# Altium schematic sheet analog_channel3.SchDoc
size A4; SheetNumber: 4; SheetTotal: 6
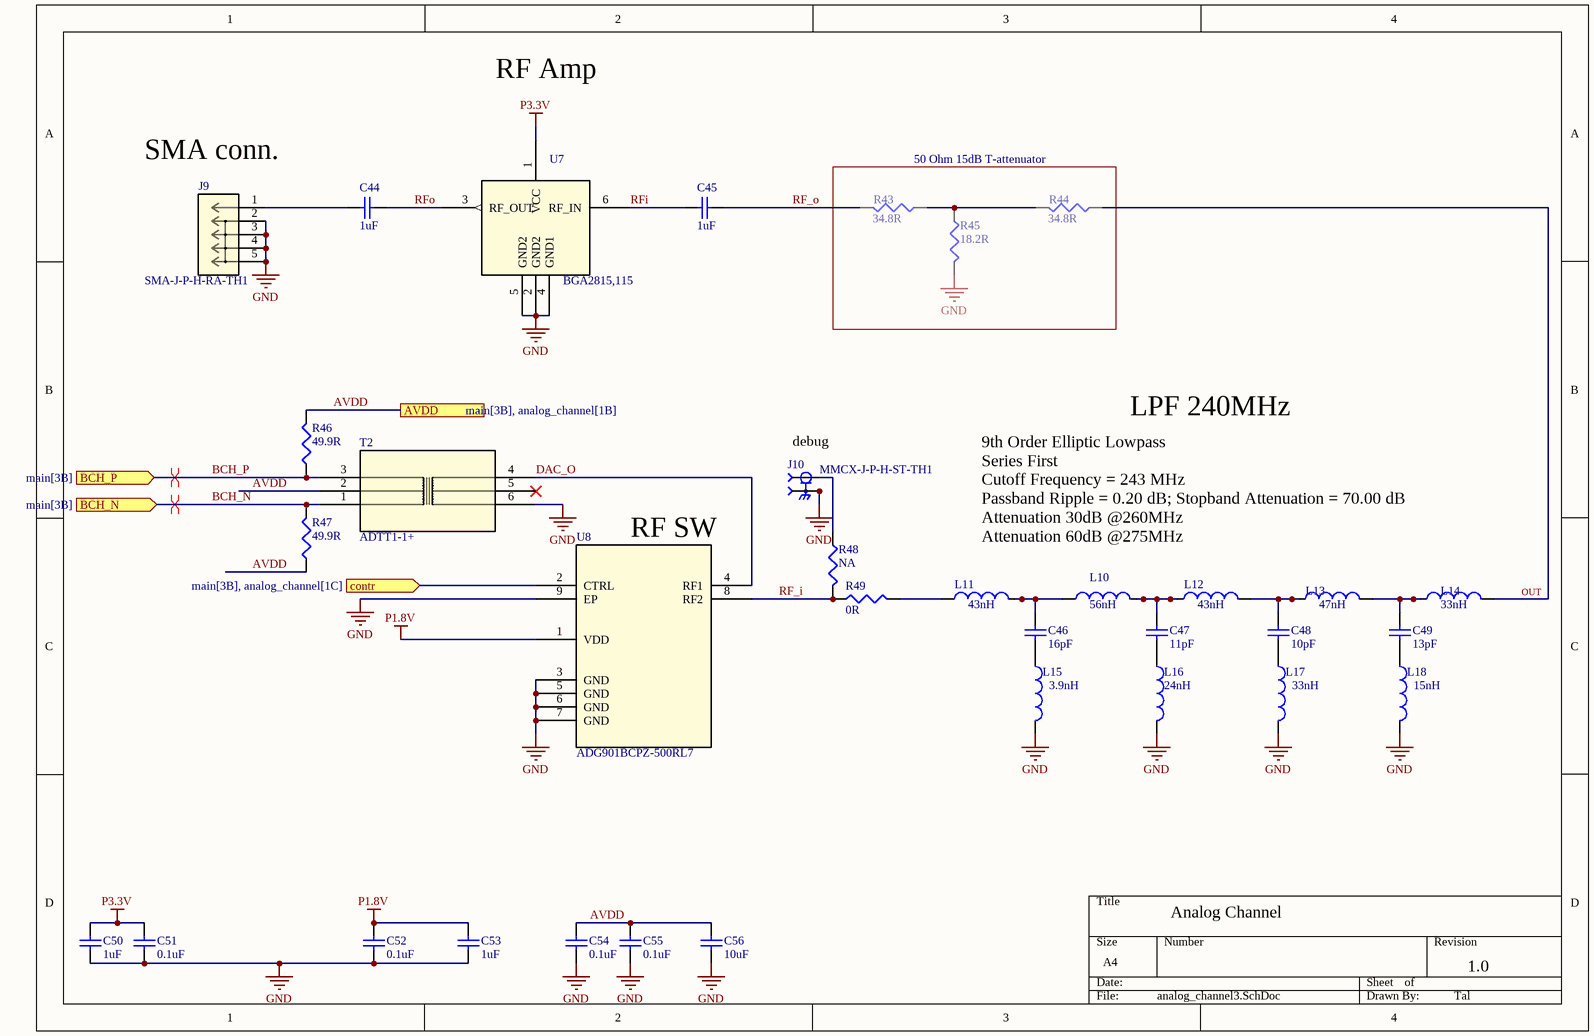
[diagram p0: analog_channel3.SchDoc]

## Parts
C44  Capacitance: 1uF  [c0402]  (hidden comment: 1uF 25V)
C45  Capacitance: 1uF  [c0402]  (hidden comment: 1uF 25V)
C46  Capacitance: 16pF  [c0402]  (hidden comment: 16pF 50V)
C47  Capacitance: 11pF  [c0402]  (hidden comment: 11pF 50V)
C48  Capacitance: 10pF  [c0402]  (hidden comment: 10pF 50V)
C49  Capacitance: 13pF  [c0402]  (hidden comment: 13pF 50V)
C50  Capacitance: 1uF  [c0402]  (hidden comment: 1uF 25V)
C51  Capacitance: 0.1uF  [c0402]  (hidden comment: 0.1uF 50V)
C52  Capacitance: 0.1uF  [c0402]  (hidden comment: 0.1uF 50V)
C53  Capacitance: 1uF  [c0402]  (hidden comment: 1uF 25V)
C54  Capacitance: 0.1uF  [c0402]  (hidden comment: 0.1uF 50V)
C55  Capacitance: 0.1uF  [c0402]  (hidden comment: 0.1uF 50V)
C56  Capacitance: 10uF  [c0402]  (hidden comment: 10uF 10V)
J9  SMA-J-P-H-RA-TH1  [CONN_SMA-J-P-H-RA-TH1_SAI]
J10  MMCX-J-P-H-ST-TH1  [SAMTEC_MMCX-J-P-H-ST-TH1]
L10  value 56nH  [0402-A]  (hidden comment: Inductor)
L11  value 43nH  [0402-A]  (hidden comment: Inductor)
L12  value 43nH  [0402-A]  (hidden comment: Inductor)
L13  value 47nH  [0402-A]  (hidden comment: Inductor)
L14  value 33nH  [0402-A]  (hidden comment: Inductor)
L15  value 3.9nH  [0402-A]  (hidden comment: Inductor)
L16  value 24nH  [0402-A]  (hidden comment: Inductor)
L17  value 33nH  [0402-A]  (hidden comment: Inductor)
L18  value 15nH  [0402-A]  (hidden comment: Inductor)
R43  34.8R  [r0402]
R44  34.8R  [r0402]
R45  18.2R  [r0402]
R46  49.9R  [r0402]
R47  49.9R  [r0402]
R48  NA  [r0402]
R49  0R  [r0402]
T2  ADTT1-1+  [CD542_MNC]
U7  BGA2815,115  [SOT_2815,115_NXP]
U8  ADG901BCPZ-500RL7  [CP_8_2_ADI]

## Blocks framed on the sheet
50 Ohm 15dB T-attenuator: R43-R45

## Ports
AVDD (see main[3B], analog_channel[1B]), BCH_N (in, see main[3B]), BCH_P (in, see main[3B]), contr (in, see main[3B], analog_channel[1C])

## Nets
GND: C50.1 C51.1 C52.1 C53.1 C54.1 C55.1 C56.1 J9.2 J9.3 J9.4 J9.5 J10.S1 J10.S2 J10.S3 J10.S4 L15.2 L16.2 L17.2 L18.2 R45.2 T2.6 U7.2(GND2) U7.4(GND1) U7.5(GND2) U8.3(GND) U8.5(GND) U8.6(GND) U8.7(GND) U8.9(EP)
P1.8V: C52.2 C53.2 U8.1(VDD)
P3.3V: C50.2 C51.2 U7.1(VCC)
AVDD: C54.2 C55.2 C56.2 R46.2 R47.1 T2.2 ; port AVDD
BCH_N: R47.2 T2.1 ; port BCH_N
BCH_P: R46.1 T2.3 ; port BCH_P
contr: U8.2(CTRL) ; port contr
DAC_O: T2.4 U8.4(RF1)
OUT: L14.2 R44.1
RF_i: R48.2 R49.1 U8.8(RF2)
RF_o: C45.2 R43.2
RFi: C45.1 U7.6(RF_IN)
RFo: C44.2 U7.3(RF_OUT)
NetC44_1: C44.1 J9.1
NetC46_1: C46.1 L10.1 L11.2
NetC46_2: C46.2 L15.1
NetC47_1: C47.1 L10.2 L12.1
NetC47_2: C47.2 L16.1
NetC48_1: C48.1 L12.2 L13.1
NetC48_2: C48.2 L17.1
NetC49_1: C49.1 L13.2 L14.1
NetC49_2: C49.2 L18.1
NetJ10_1: J10.1 R48.1
NetL11_1: L11.1 R49.2
NetR43_1: R43.1 R44.2 R45.1

Not connected (* = marked no-connect by the designer): T2 5*

## Layout directives
differential pair: BCH_N, BCH_P

## Notes on the sheet
- RF Amp
- (near J9) SMA conn.
- (near J10) debug
- LPF 240MHz
- (near U8) RF SW
- 9th Order Elliptic Lowpass
  Series First
  Cutoff Frequency = 243 MHz
  Passband Ripple = 0.20 dB; Stopband Attenuation = 70.00 dB
  Attenuation 30dB @260MHz
  Attenuation 60dB @275MHz
- Analog Channel
- 1.0
- Tal

## Library data of the parts
C44 C45 C50 C53 = CAP CER 6.8pF 50V NP0 0402: CAP CER 1uF 25V X5R 0402; Manufacturer Part Number: C1005C0G1H6R8D; Manufacturer: TDK Corporation; LANDA P/N: ECP-000033; Voltage - Rated: 50V; RoHS: RoHS Compliant; Package / Case: 0402 (1005 Metric); ComponentLink1URL: http://www.tdk.com/pdf/general_B11.pdf; ComponentLink1Description: http://www.tdk.com/pdf/general_B11.pdf
C46 = CAP CER 20pF 50V 5% NP0 0402: CAP CER 16PF 50V 5% NP0 0402; Manufacturer: TDK Corporation; Manufacturer Part Number: C1005C0G1H200J; LANDA P/N: ECP-000034; Package / Case: 0402 (1005 Metric); RoHS: RoHS Compliant; ComponentLink1URL: http://www.tdk.com/pdf/general_B11.pdf; ComponentLink1Description: http://www.tdk.com/pdf/general_B11.pdf; Voltage - Rated: 50V
C47 = CAP CER 20pF 50V 5% NP0 0402: CAP CER 11PF 50V 5% NP0 0402; Manufacturer: TDK Corporation; Manufacturer Part Number: C1005C0G1H200J; LANDA P/N: ECP-000034; Package / Case: 0402 (1005 Metric); RoHS: RoHS Compliant; ComponentLink1URL: http://www.tdk.com/pdf/general_B11.pdf; ComponentLink1Description: http://www.tdk.com/pdf/general_B11.pdf; Voltage - Rated: 50V
C48 = CAP CER 20pF 50V 5% NP0 0402: CAP CER 10PF 50V 5% NP0 0402; Manufacturer: TDK Corporation; Manufacturer Part Number: C1005C0G1H200J; LANDA P/N: ECP-000034; Package / Case: 0402 (1005 Metric); RoHS: RoHS Compliant; ComponentLink1URL: http://www.tdk.com/pdf/general_B11.pdf; ComponentLink1Description: http://www.tdk.com/pdf/general_B11.pdf; Voltage - Rated: 50V
C49 = CAP CER 20pF 50V 5% NP0 0402: CAP CER 13PF 50V 5% NP0 0402; Manufacturer: TDK Corporation; Manufacturer Part Number: C1005C0G1H200J; LANDA P/N: ECP-000034; Package / Case: 0402 (1005 Metric); RoHS: RoHS Compliant; ComponentLink1URL: http://www.tdk.com/pdf/general_B11.pdf; ComponentLink1Description: http://www.tdk.com/pdf/general_B11.pdf; Voltage - Rated: 50V
C51 C52 C54 C55 = CAP CER 6.8pF 50V NP0 0402: CAP CER 0.1uF 50V NP0 0402; Manufacturer Part Number: C1005C0G1H6R8D; Manufacturer: TDK Corporation; LANDA P/N: ECP-000033; RoHS: RoHS Compliant; Package / Case: 0402 (1005 Metric); ComponentLink1URL: http://www.tdk.com/pdf/general_B11.pdf; ComponentLink1Description: http://www.tdk.com/pdf/general_B11.pdf; Voltage - Rated: 50V
C56 = CAP CER 6.8pF 50V NP0 0402: CAP CER 10uF 10V X5R 0402; Manufacturer Part Number: C1005C0G1H6R8D; Manufacturer: TDK Corporation; LANDA P/N: ECP-000033; Voltage - Rated: 50V; RoHS: RoHS Compliant; Package / Case: 0402 (1005 Metric); ComponentLink1URL: http://www.tdk.com/pdf/general_B11.pdf; ComponentLink1Description: http://www.tdk.com/pdf/general_B11.pdf
J9 = SMA-J-P-H-RA-TH1: No Description Available; Mfr_Name: Samtec Inc; Copyright: Copyright (C) 2023 Ultra Librarian. All rights reserved.; Manufacturer_Part_Number: SMA-J-P-H-RA-TH1; RefDes: RefDes; Type: DEV
J10 = MMCX-J-P-H-ST-TH1: MMCX STRAIGHT, THROUGH HOLE JACK- 50 OHM; MF: Samtec; MP: MMCX-J-P-H-ST-TH1; Price: None; Package: None; Value: *; Availability: Unavailable
L10-L18 = Inductor: Code_IEC: 1005; Published: 8-Jun-2000; LatestRevisionDate: 29-May-2009; LatestRevisionNote: IPC-7351 Footprint Added.; PackageReference: 0402-A; Publisher: Altium Limited; PackageDescription: Chip Inductor; Code_JEITA: 0402
R43 R44 = RES 100 OHM 1/10W 1% 0402 SMD: RES 34.8 OHM 1/10W 1% 0402 SMD; Manufacturer Part Number: ERJ-2RKF1000X; Manufacturer: Panasonic Electronic Components; LANDA P/N: ERS-000079; Assembly: N.C; Package / Case: 0402 (1005 Metric); RoHS: RoHS Compliant; ComponentLink1URL: http://industrial.panasonic.com/www-cgi/jvcr13pz.cgi?E+PZ+3+AOA0002+ERJ2RKF1000X+7+WW; ComponentLink1Description: http://industrial.panasonic.com/www-cgi/jvcr13pz.cgi?E+PZ+3+AOA0002+ERJ2RKF1000X+7+WW; Supplier Device Package: 0402
R45 = RES 100 OHM 1/10W 1% 0402 SMD: RES 18.2 OHM 1/10W 1% 0402 SMD; Manufacturer Part Number: ERJ-2RKF1000X; Manufacturer: Panasonic Electronic Components; LANDA P/N: ERS-000079; Assembly: N.C; Package / Case: 0402 (1005 Metric); RoHS: RoHS Compliant; ComponentLink1URL: http://industrial.panasonic.com/www-cgi/jvcr13pz.cgi?E+PZ+3+AOA0002+ERJ2RKF1000X+7+WW; ComponentLink1Description: http://industrial.panasonic.com/www-cgi/jvcr13pz.cgi?E+PZ+3+AOA0002+ERJ2RKF1000X+7+WW; Supplier Device Package: 0402
R46 R47 = RES 100 OHM 1/10W 1% 0402 SMD: RES 49.9 OHM 1/10W 1% 0402 SMD; Manufacturer Part Number: ERJ-2RKF1000X; Manufacturer: Panasonic Electronic Components; LANDA P/N: ERS-000079; Assembly: N.C; Package / Case: 0402 (1005 Metric); RoHS: RoHS Compliant; ComponentLink1URL: http://industrial.panasonic.com/www-cgi/jvcr13pz.cgi?E+PZ+3+AOA0002+ERJ2RKF1000X+7+WW; ComponentLink1Description: http://industrial.panasonic.com/www-cgi/jvcr13pz.cgi?E+PZ+3+AOA0002+ERJ2RKF1000X+7+WW; Supplier Device Package: 0402
R48 R49 = RES 100 OHM 1/10W 1% 0402 SMD: RES 0 OHM 1/10W 1% 0402 SMD; Manufacturer Part Number: ERJ-2RKF1000X; Manufacturer: Panasonic Electronic Components; LANDA P/N: ERS-000079; Assembly: N.C; Package / Case: 0402 (1005 Metric); RoHS: RoHS Compliant; ComponentLink1URL: http://industrial.panasonic.com/www-cgi/jvcr13pz.cgi?E+PZ+3+AOA0002+ERJ2RKF1000X+7+WW; ComponentLink1Description: http://industrial.panasonic.com/www-cgi/jvcr13pz.cgi?E+PZ+3+AOA0002+ERJ2RKF1000X+7+WW; Supplier Device Package: 0402
T2 = ADTT1-1+: No Description Available; Mfr_Name: Mini Circuits; Type: DEV; Copyright: Copyright (C) 2023 Ultra Librarian. All rights reserved.; Manufacturer_Part_Number: ADTT1-1+; RefDes: RefDes
U7 = BGA2815,115: No Description Available; Mfr_Name: NXP; Copyright: Copyright (C) 2023 Ultra Librarian. All rights reserved.; Manufacturer_Part_Number: BGA2815,115; RefDes: RefDes; Type: DEV
U8 = ADG901BCPZ-500RL7: No Description Available; Mfr_Name: Analog Devices Inc; Copyright: Copyright (C) 2023 Ultra Librarian. All rights reserved.; Manufacturer_Part_Number: ADG901BCPZ-500RL7; RefDes: RefDes; Type: DEV